# Altium project Kretsn_Brillz.PrjPcb
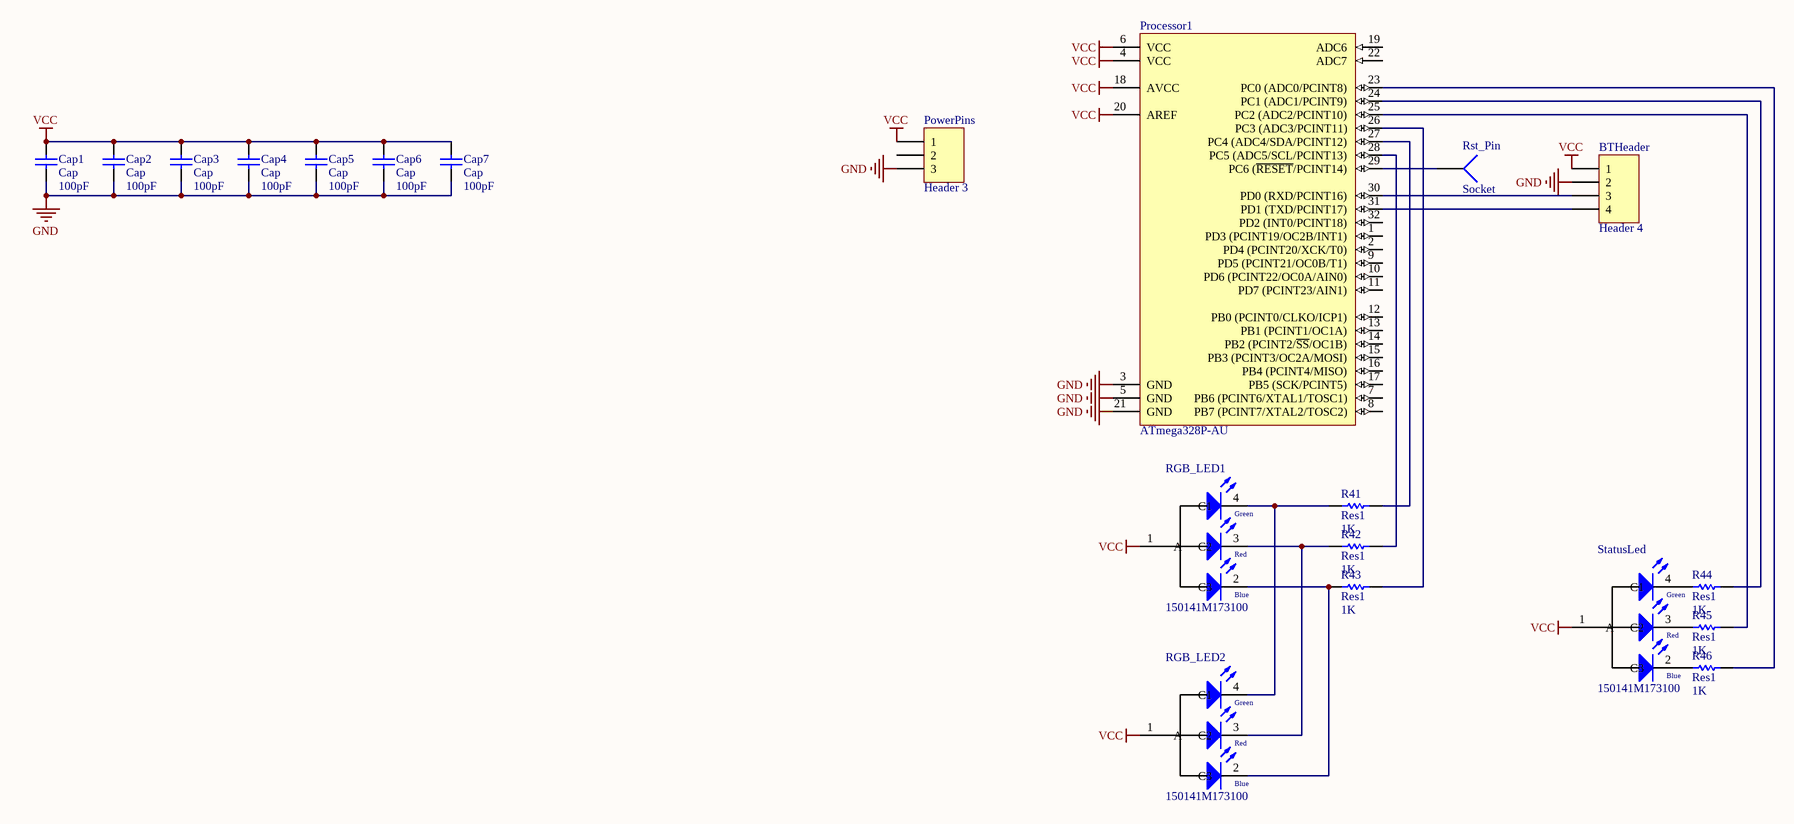
[diagram p0: Kretsn_Brillz.SchDoc]
1 sheet, 20 parts. Net scope: global (net labels, ports and power ports of the same name join across sheets).
Board file: Kretsn_Brillz.PcbDoc

## Sheet Kretsn_Brillz.SchDoc
size A1

### Parts
BTHeader  Header 4  [HDR1X4]
Cap1  Cap  value 100pF  [6-0805_N]
Cap2  Cap  value 100pF  [6-0805_N]
Cap3  Cap  value 100pF  [6-0805_N]
Cap4  Cap  value 100pF  [6-0805_N]
Cap5  Cap  value 100pF  [6-0805_N]
Cap6  Cap  value 100pF  [6-0805_N]
Cap7  Cap  value 100pF  [6-0805_N]
PowerPins  Header 3  [HDR1X3]
Processor1  ATmega328P-AU  [32A_N]
R41  Res1  value 1K  [6-0805_N]
R42  Res1  value 1K  [6-0805_N]
R43  Res1  value 1K  [6-0805_N]
R44  Res1  value 1K  [6-0805_N]
R45  Res1  value 1K  [6-0805_N]
R46  Res1  value 1K  [6-0805_N]
RGB_LED1  150141M173100  [3528]
RGB_LED2  150141M173100  [3528]
Rst_Pin  Socket  [PIN1]
StatusLed  150141M173100  [3528]

### Nets
GND: BTHeader.2 Cap1.1 Cap2.1 Cap3.1 Cap4.2 Cap5.2 Cap6.2 Cap7.2 PowerPins.3 Processor1.3(GND) Processor1.5(GND) Processor1.21(GND)
VCC: BTHeader.1 Cap1.2 Cap2.2 Cap3.2 Cap4.1 Cap5.1 Cap6.1 Cap7.1 PowerPins.1 Processor1.4(VCC) Processor1.6(VCC) Processor1.18(AVCC) Processor1.20(AREF) RGB_LED1.1(A) RGB_LED2.1(A) StatusLed.1(A)
NetBTHeader_3: BTHeader.3 Processor1.30(PD0_(RXD/PCINT16))
NetBTHeader_4: BTHeader.4 Processor1.31(PD1_(TXD/PCINT17))
NetProcessor1_23: Processor1.23(PC0_(ADC0/PCINT8)) R46.2
NetProcessor1_24: Processor1.24(PC1_(ADC1/PCINT9)) R44.2
NetProcessor1_25: Processor1.25(PC2_(ADC2/PCINT10)) R45.2
NetProcessor1_26: Processor1.26(PC3_(ADC3/PCINT11)) R43.2
NetProcessor1_27: Processor1.27(PC4_(ADC4/SDA/PCINT12)) R41.2
NetProcessor1_28: Processor1.28(PC5_(ADC5/SCL/PCINT13)) R42.2
NetProcessor1_29: Processor1.29(PC6_(~{RESET}/PCINT14)) Rst_Pin.1
NetR41_1: R41.1 RGB_LED1.4(C1) RGB_LED2.4(C1)
NetR42_1: R42.1 RGB_LED1.3(C2) RGB_LED2.3(C2)
NetR43_1: R43.1 RGB_LED1.2(C3) RGB_LED2.2(C3)
NetR44_1: R44.1 StatusLed.4(C1)
NetR45_1: R45.1 StatusLed.3(C2)
NetR46_1: R46.1 StatusLed.2(C3)

Not connected (* = marked no-connect by the designer): PowerPins 2; Processor1 1(PD3_(PCINT19/OC2B/INT1)) 2(PD4_(PCINT20/XCK/T0)) 7(PB6_(PCINT6/XTAL1/TOSC1)) 8(PB7_(PCINT7/XTAL2/TOSC2)) 9(PD5_(PCINT21/OC0B/T1)) 10(PD6_(PCINT22/OC0A/AIN0)) 11(PD7_(PCINT23/AIN1)) 12(PB0_(PCINT0/CLKO/ICP1)) 13(PB1_(PCINT1/OC1A)) 14(PB2_(PCINT2/~{SS}/OC1B)) 15(PB3_(PCINT3/OC2A/MOSI)) 16(PB4_(PCINT4/MISO)) 17(PB5_(SCK/PCINT5)) 19(ADC6) 22(ADC7) 32(PD2_(INT0/PCINT18))

### Notes on the sheet
- (in symbol WL-SFTW 3528 150141M173100) Green; Red; Blue

### Library data of the parts
BTHeader = Header 4: Header, 4-Pin; LatestRevisionDate: 17-Jul-2002; LatestRevisionNote: Re-released for DXP Platform.; Publisher: Altium Limited
Cap1-Cap7 = Cap: Capacitor; Published: 8-Jun-2000; LatestRevisionDate: 17-Jul-2002; LatestRevisionNote: Re-released for DXP Platform.; PackageReference: RAD-0.3; Publisher: Altium Limited; PackageDescription: Radial Cap, Thru-Hole; 2 Leads; 0.3 in Pin Spacing
PowerPins = Header 3: Header, 3-Pin; LatestRevisionDate: 17-Jul-2002; LatestRevisionNote: Re-released for DXP Platform.; Publisher: Altium Limited
Processor1 = ATmega328P-AU: 8-bit AVR Microcontroller, 32KB Flash, 1KB EEPROM, 2KB SRAM, 32-pin TQFP, Industrial Grade (-40°C to 85°C); Published: 1-Apr-2010; DatasheetVersion: revA, Jan-2010; PackageVersion: revB, Oct-2001; PackageReference: 32A; Publisher: Altium Limited; PackageDescription: 32-Lead, 7x7x1.0 mm Body, 0.8mm Lead Pitch, Thin Profile Plastic Quad Flat Package (TQFP); Supplier 1: Digi-Key; Supplier Part Number 1: ATMEGA328P-AU-ND; Supplier 2: Farnell; Supplier Part Number 2: 1715486; Supplier 3: Mouser; Supplier Part Number 3: 556-ATMEGA328P-AU; Code_JEDEC: MS-026-ABA; ComponentLink1Description: Manufacturer Link; ComponentLink1URL: http://www.atmel.com/products/avr/default.asp?; ComponentLink2Description: ATmega48A/48PA/88A/88PA/168A/168PA/328/328P Datasheet; ComponentLink2URL: http://www.atmel.com/dyn/resources/prod_documents/8271.pdf; ComponentLink3Description: ATmega48A/48PA/88A/88PA/168A/168PA/328/328P Summary; ComponentLink3URL: http://www.atmel.com/dyn/resources/prod_documents/8271S.pdf; ComponentLink4Description: Atmel.com Home; ComponentLink4URL: http://www.atmel.com
R41-R46 = Res1: Resistor; Published: 8-Jun-2000; LatestRevisionDate: 17-Jul-2002; LatestRevisionNote: Re-released for DXP Platform.; PackageReference: AXIAL-0.3; Publisher: Altium Limited; PackageDescription: Axial Device, Thru-Hole; 2 Leads; 0.3 in Pin Spacing
RGB_LED1 RGB_LED2 StatusLed = WL-SFTW 3528 150141M173100: SMD Full-Color Top LED, WL-SFTW, Red & Green & Blue; Manufacturer: Würth Elektronik eiSos GmbH; PartNo: 150141M173100; ComponentLink1Description: Manufacturer; ComponentLink1URL: http://www.we-online.de; Created by: Christin Otto; Created Date: June 2013; ComponentLink2Description: Datasheet; ComponentLink2URL: http://katalog.we-online.com/led/datasheet/150141M173100.pdf; Color: Red & Green & Blue
Rst_Pin = Socket: LatestRevisionDate: 17-Jul-2002; LatestRevisionNote: Re-released for DXP Platform.; Publisher: Altium Limited